# Altium project HBAT cell.PrjPcb
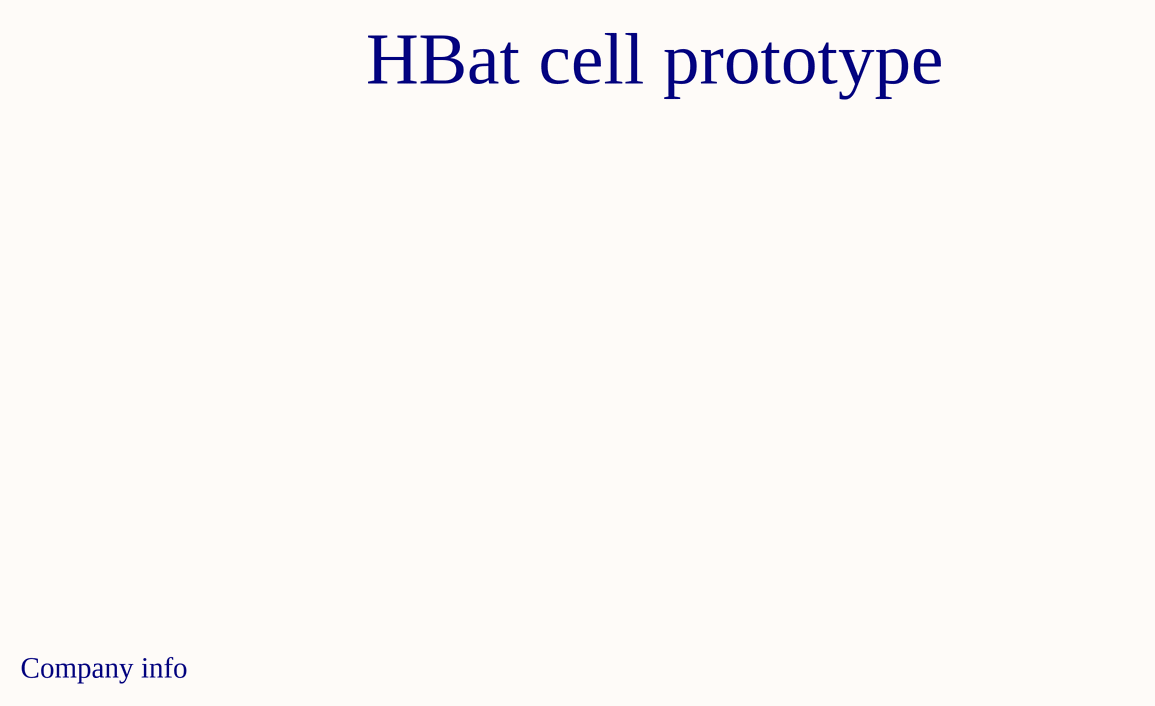
[diagram p0: Title page.SchDoc]
4 sheets, 7 parts. Net scope: global (net labels, ports and power ports of the same name join across sheets).
Board file: Cathode side.PcbDoc
Sheets:
  Title page.SchDoc
  requirements.SchDoc
  periferels.SchDoc
  mcu.SchDoc

## Sheet Title page.SchDoc
size A4; SheetNumber: 1; SheetTotal: 4

### Notes on the sheet
- HBat cell prototype
- Company info

## Sheet requirements.SchDoc
size A4; SheetNumber: 2; SheetTotal: 3
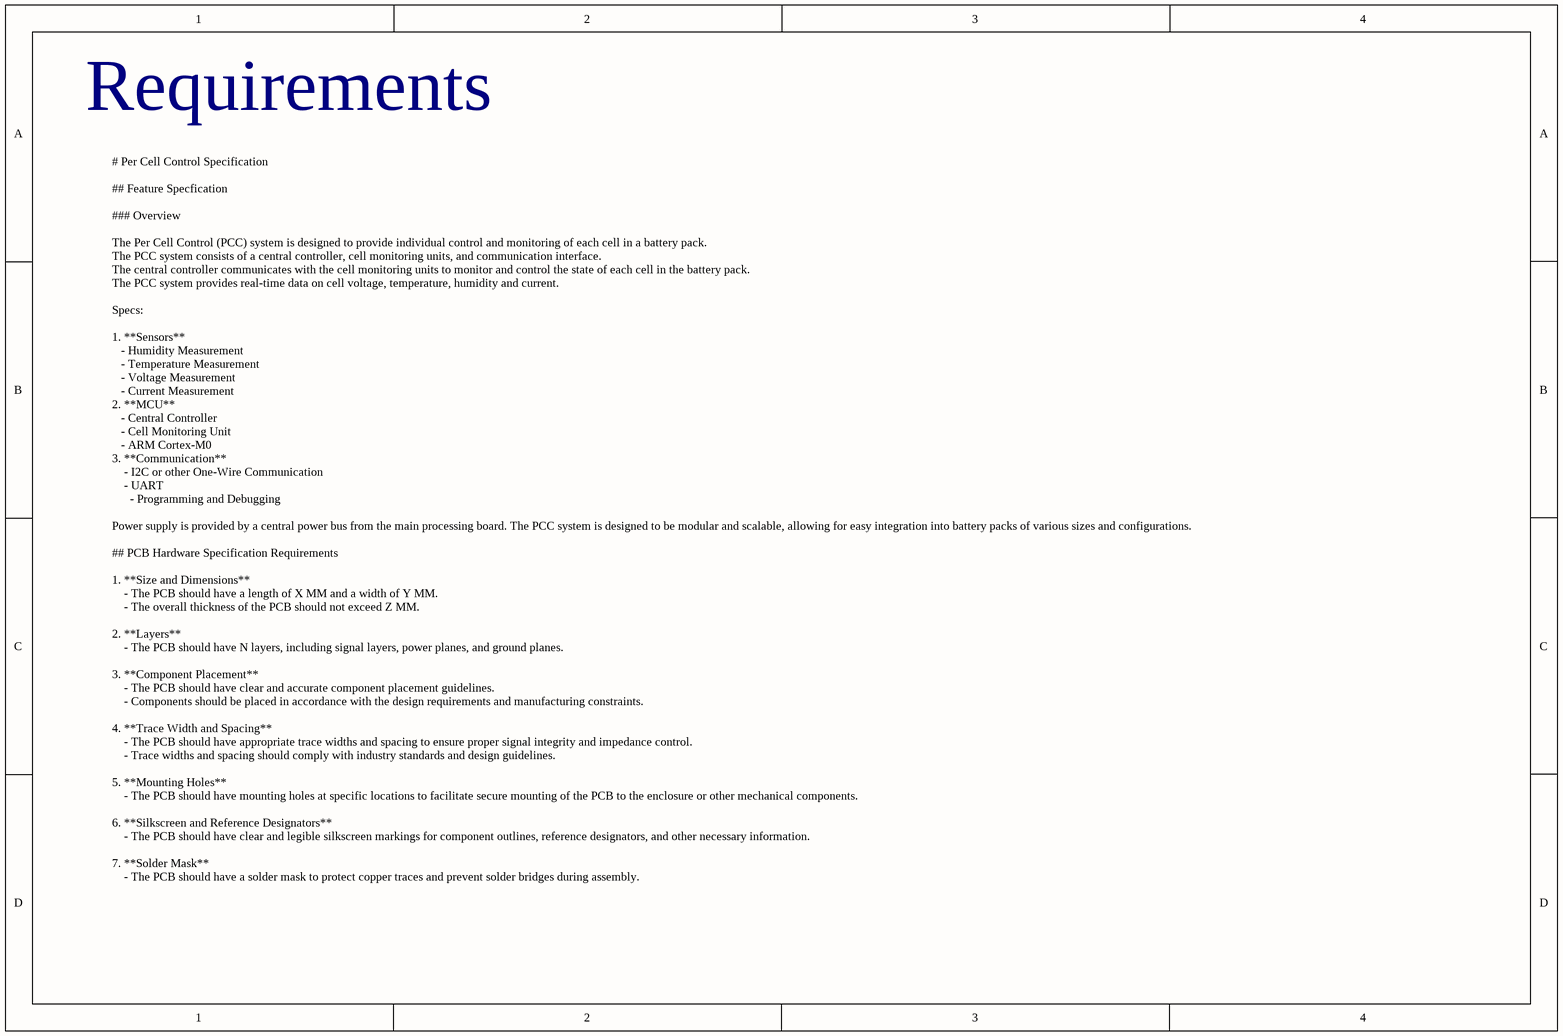
[diagram p1: requirements.SchDoc]

### Notes on the sheet
- Requirements
- # Per Cell Control Specification
  ## Feature Specfication
  ### Overview
  The Per Cell Control (PCC) system is designed to provide individual control and monitoring of each cell in a battery pack.
  The PCC system consists of a central controller, cell monitoring units, and communication interface.
  The central controller communicates with the cell monitoring units to monitor and control the state of each cell in the battery pack.
  The PCC system provides real-time data on cell voltage, temperature, humidity and current.
  Specs:
  1. **Sensors**
  - Humidity Measurement
  - Temperature Measurement
  - Voltage Measurement
  - Current Measurement
  2. **MCU**
  - Central Controller
  - Cell Monitoring Unit
  - ARM Cortex-M0
  3. **Communication**
  - I2C or other One-Wire Communication
  - UART
  - Programming and Debugging
  Power supply is provided by a central power bus from the main processing board. The PCC system is designed to be modular and scalable, allowing for easy integration into battery packs of various sizes and configurations.
  ## PCB Hardware Specification Requirements
  1. **Size and Dimensions**
  - The PCB should have a length of X MM and a width of Y MM.
  - The overall thickness of the PCB should not exceed Z MM.
  2. **Layers**
  - The PCB should have N layers, including signal layers, power planes, and ground planes.
  3. **Component Placement**
  - The PCB should have clear and accurate component placement guidelines.
  - Components should be placed in accordance with the design requirements and manufacturing constraints.
  4. **Trace Width and Spacing**
  - The PCB should have appropriate trace widths and spacing to ensure proper signal integrity and impedance control.
  - Trace widths and spacing should comply with industry standards and design guidelines.
  5. **Mounting Holes**
  - The PCB should have mounting holes at specific locations to facilitate secure mounting of the PCB to the enclosure or other mechanical components.
  6. **Silkscreen and Reference Designators**
  - The PCB should have clear and legible silkscreen markings for component outlines, reference designators, and other necessary information.
  7. **Solder Mask**
  - The PCB should have a solder mask to protect copper traces and prevent solder bridges during assembly.
  8. **Testing Points**
  - The PCB should have designated testing points for easy access during manufacturing and testing processes.
  9. **Connector and Interface Requirements**
  - The PCB should have specific connector and interface requirements, including pinouts, signal assignments, and mechanical dimensions.
  10. **Environmental Considerations**
  - The PCB should meet environmental requirements such as temperature, humidity, and vibration resistance.

## Sheet periferels.SchDoc
size A4; SheetNumber: 3; SheetTotal: 4
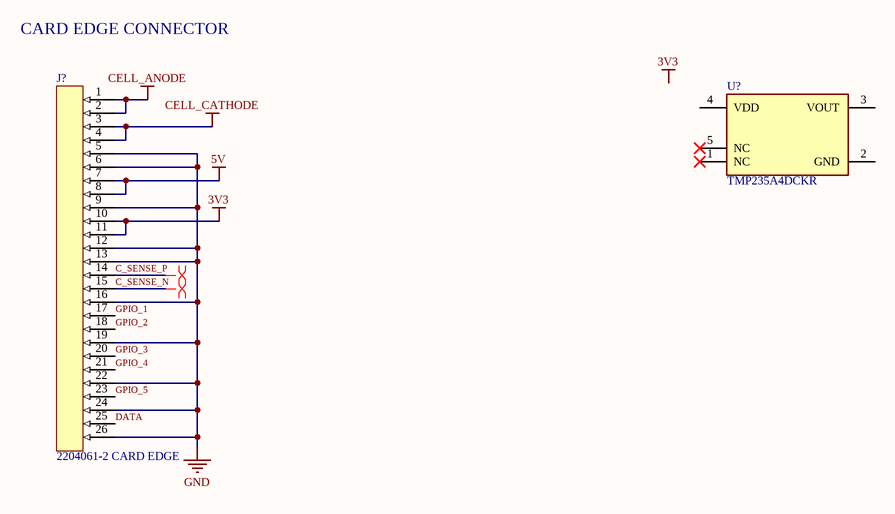
[diagram p2: periferels.SchDoc]

### Parts
(Parts that share a designator on the sheet are numbered #1, #2 ... from top to bottom, then left to right.)
J?  2204061-2 CARD EDGE  [2204061-2 CARD EDGE-Footprint-1]
U?#1  TMP235A4DCKR  [FP-DCK0005A-MFG]

### Nets
3V3: J?.10 J?.11
5V: J?.7 J?.8
CELL_ANODE: J?.1 J?.2
CELL_CATHODE: J?.3 J?.4
GND: J?.5 J?.6 J?.9 J?.12 J?.13 J?.16 J?.19 J?.22 J?.24 J?.26
C_SENSE_N: J?.15
C_SENSE_P: J?.14
DATA: J?.25
GPIO_1: J?.17
GPIO_2: J?.18
GPIO_3: J?.20
GPIO_4: J?.21
GPIO_5: J?.23

Not connected (* = marked no-connect by the designer): U?#1 1(NC)* 2(GND) 3(VOUT) 4(VDD) 5(NC)*

### Layout directives
differential pair: C_SENSE_N, C_SENSE_P

### Notes on the sheet
- CARD EDGE CONNECTOR
- Labels drawn without touching a wire or pin: 3V3

### Library data of the parts
J? = CMP-002-00073-1
U?#1 = CMP-04948-000022-1: SENSOR ANALOG -40C-150C SC70-5; Manufacturer: Texas Instruments; Max Junction Temp: +150°C; Output Current: 500uA; Standoff Height: 0mm; Output Voltage: 100-2000mV; Operating Supply Current: 9-10uA; Min Supply Voltage: 2.3V; Sensor Output: Analog Voltage; Max Supply Voltage: 5.5V; Description: ±1.2°C 2.3V to 5.5V analog output temperature sensor with -13.6 mV/°C gain 5-SC70 -40 to 150; Ambient Temperature Range High: +150°C; Manufacturer Part Number: TMP235A4DCKR; Temperature Range Low: -40°C; Temperature Range High: +150°C; Lead Free: Yes; Mouser Description: ±2.5°C Analog output temperature sensor, with 10mV /°C gain 5-SC70 -40 to 150; Height: 1.1mm; ComponentLink2Description: Datasheet; ComponentLink2URL: https://www.ti.com/lit/ds/symlink/tmp235.pdf; Device Class L1: Sensors; Ambient Temperature Range Low: -40°C; Temperature: -40°C to +150°C; Device Class L2: Temperature and Humidity Sensors; Category: IC; Digikey Description: SENSOR ANALOG -40C-150C SC70-5; Automotive: No; RoHS: TRUE; Device Class L3: unset; Package: DCK0005A; Octopart: https://octopart.com/tmp235a4dckr-texas+instruments-88184449

## Sheet mcu.SchDoc
size A4; SheetNumber: 4; SheetTotal: 4
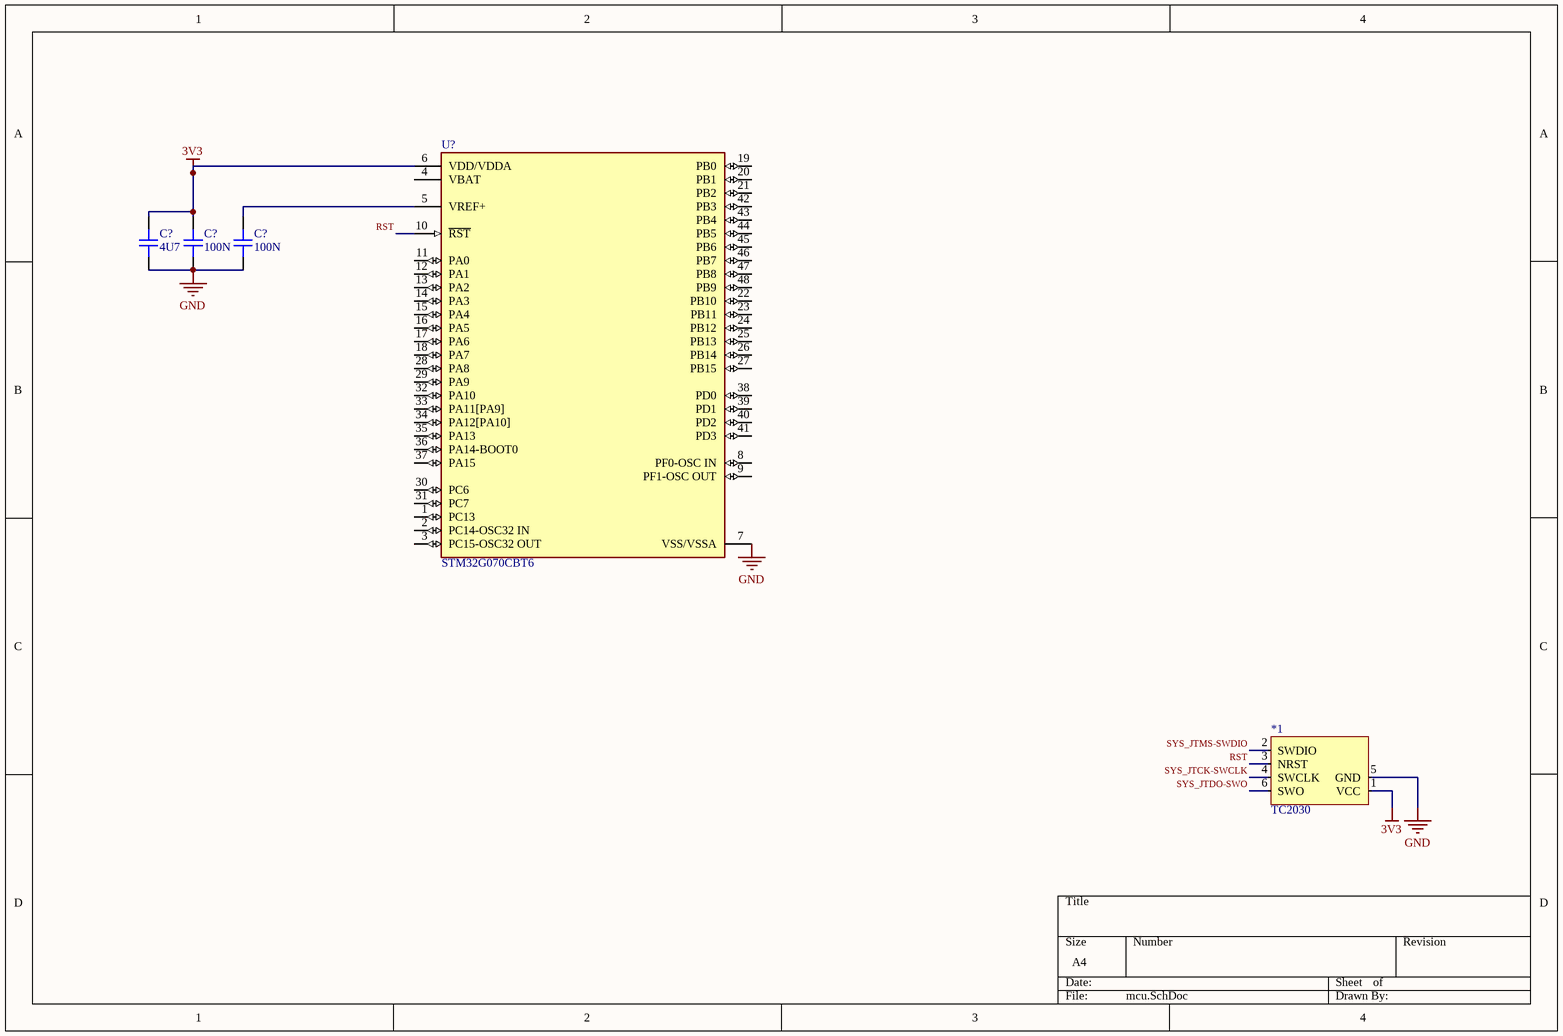
[diagram p3: mcu.SchDoc]

### Parts
(Parts that share a designator on the sheet are numbered #1, #2 ... from top to bottom, then left to right.)
*1  TC2030  [TC2030-IDC-NL]
C?#1  4U7  [CAP_0805]
C?#2  100N  [CAP_0603]
C?#3  100N  [CAP_0603]
U?#2  STM32G070CBT6  [FP-LQFP48-5B-MFG]

### Nets
3V3: *1.1(VCC) C?#1.2 C?#2.2 U?#2.6(VDD/VDDA)
GND: *1.5(GND) C?#1.1 C?#2.1 C?#3.1 U?#2.7(VSS/VSSA)
RST: *1.3(NRST) U?#2.10(~{RST})
SYS_JTCK-SWCLK: *1.4(SWCLK)
SYS_JTDO-SWO: *1.6(SWO)
SYS_JTMS-SWDIO: *1.2(SWDIO)
NetC?#3_2: C?#3.2 U?#2.5(VREF+)

Not connected (* = marked no-connect by the designer): U?#2 1(PC13) 2(PC14-OSC32_IN) 3(PC15-OSC32_OUT) 4(VBAT) 8(PF0-OSC_IN) 9(PF1-OSC_OUT) 11(PA0) 12(PA1) 13(PA2) 14(PA3) 15(PA4) 16(PA5) 17(PA6) 18(PA7) 19(PB0) 20(PB1) 21(PB2) 22(PB10) 23(PB11) 24(PB12) 25(PB13) 26(PB14) 27(PB15) 28(PA8) 29(PA9) 30(PC6) 31(PC7) 32(PA10) 33(PA11[PA9]) 34(PA12[PA10]) 35(PA13) 36(PA14-BOOT0) 37(PA15) 38(PD0) 39(PD1) 40(PD2) 41(PD3) 42(PB3) 43(PB4) 44(PB5) 45(PB6) 46(PB7) 47(PB8) 48(PB9)

### Library data of the parts
*1 = CMP-002-00072-1: Adapter Cable For Cortex
C?#1 = CAP_0805_16V: Capacitor SMD 0805 16V
C?#2 C?#3 = CAP_0603_16V: Capacitor SMD 0603 16V
U?#2 = CMP-12105-000112-1: IC MCU 32BIT 128KB FLASH 48LQFP; RoHS Compliant: Yes

## Nets that join several sheets
3V3: periferels (J?.10 J?.11), mcu (*1.1 C?#1.2 C?#2.2 U?#2.6)
GND: periferels (10 pins), mcu (5 pins)